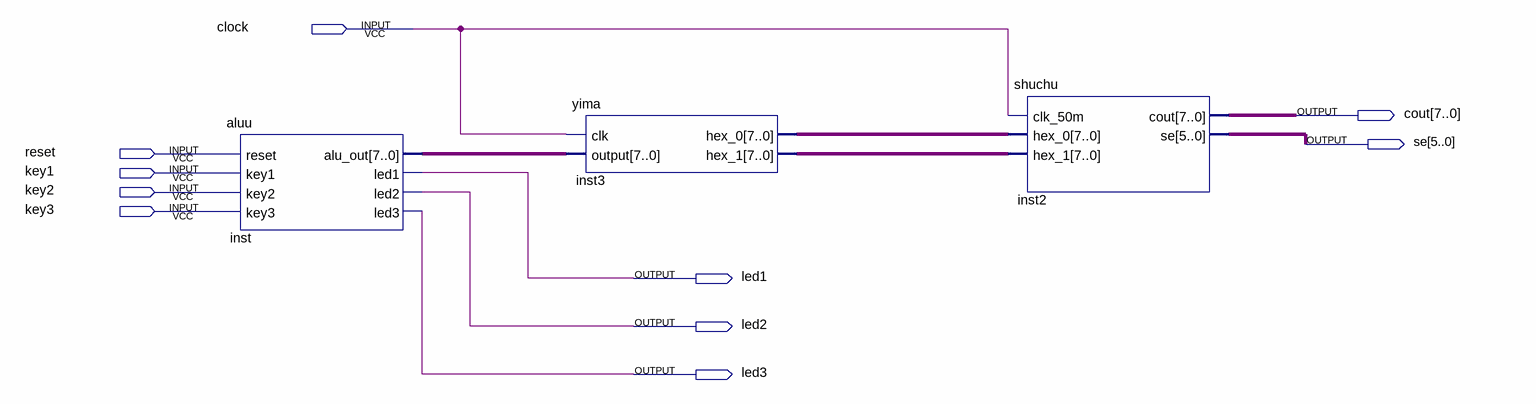
[diagram p0: schematic sheet]
// Quartus schematic alu.bdf as structural Verilog: 3 symbols, 10 pins
module alu (
  input  clock,
  input  reset,
  input  key1,
  input  key2,
  input  key3,
  output [7:0] cout,
  output [5:0] se,
  output led1,
  output led2,
  output led3
);

  wire [7:0] inst3_hex_0, inst3_hex_1, inst_alu_out;

  aluu inst (
    .reset(reset), .key1(key1), .key2(key2), .key3(key3), .alu_out(inst_alu_out), .led1(led1), .led2(led2),
    .led3(led3));
  yima inst3 (.clk(clock), .\output (inst_alu_out), .hex_0(inst3_hex_0), .hex_1(inst3_hex_1));
  shuchu inst2 (.clk_50m(clock), .hex_0(inst3_hex_0), .hex_1(inst3_hex_1), .cout(cout), .se(se));
endmodule
